# EAGLE design fbri (EAGLE 6.6.0)
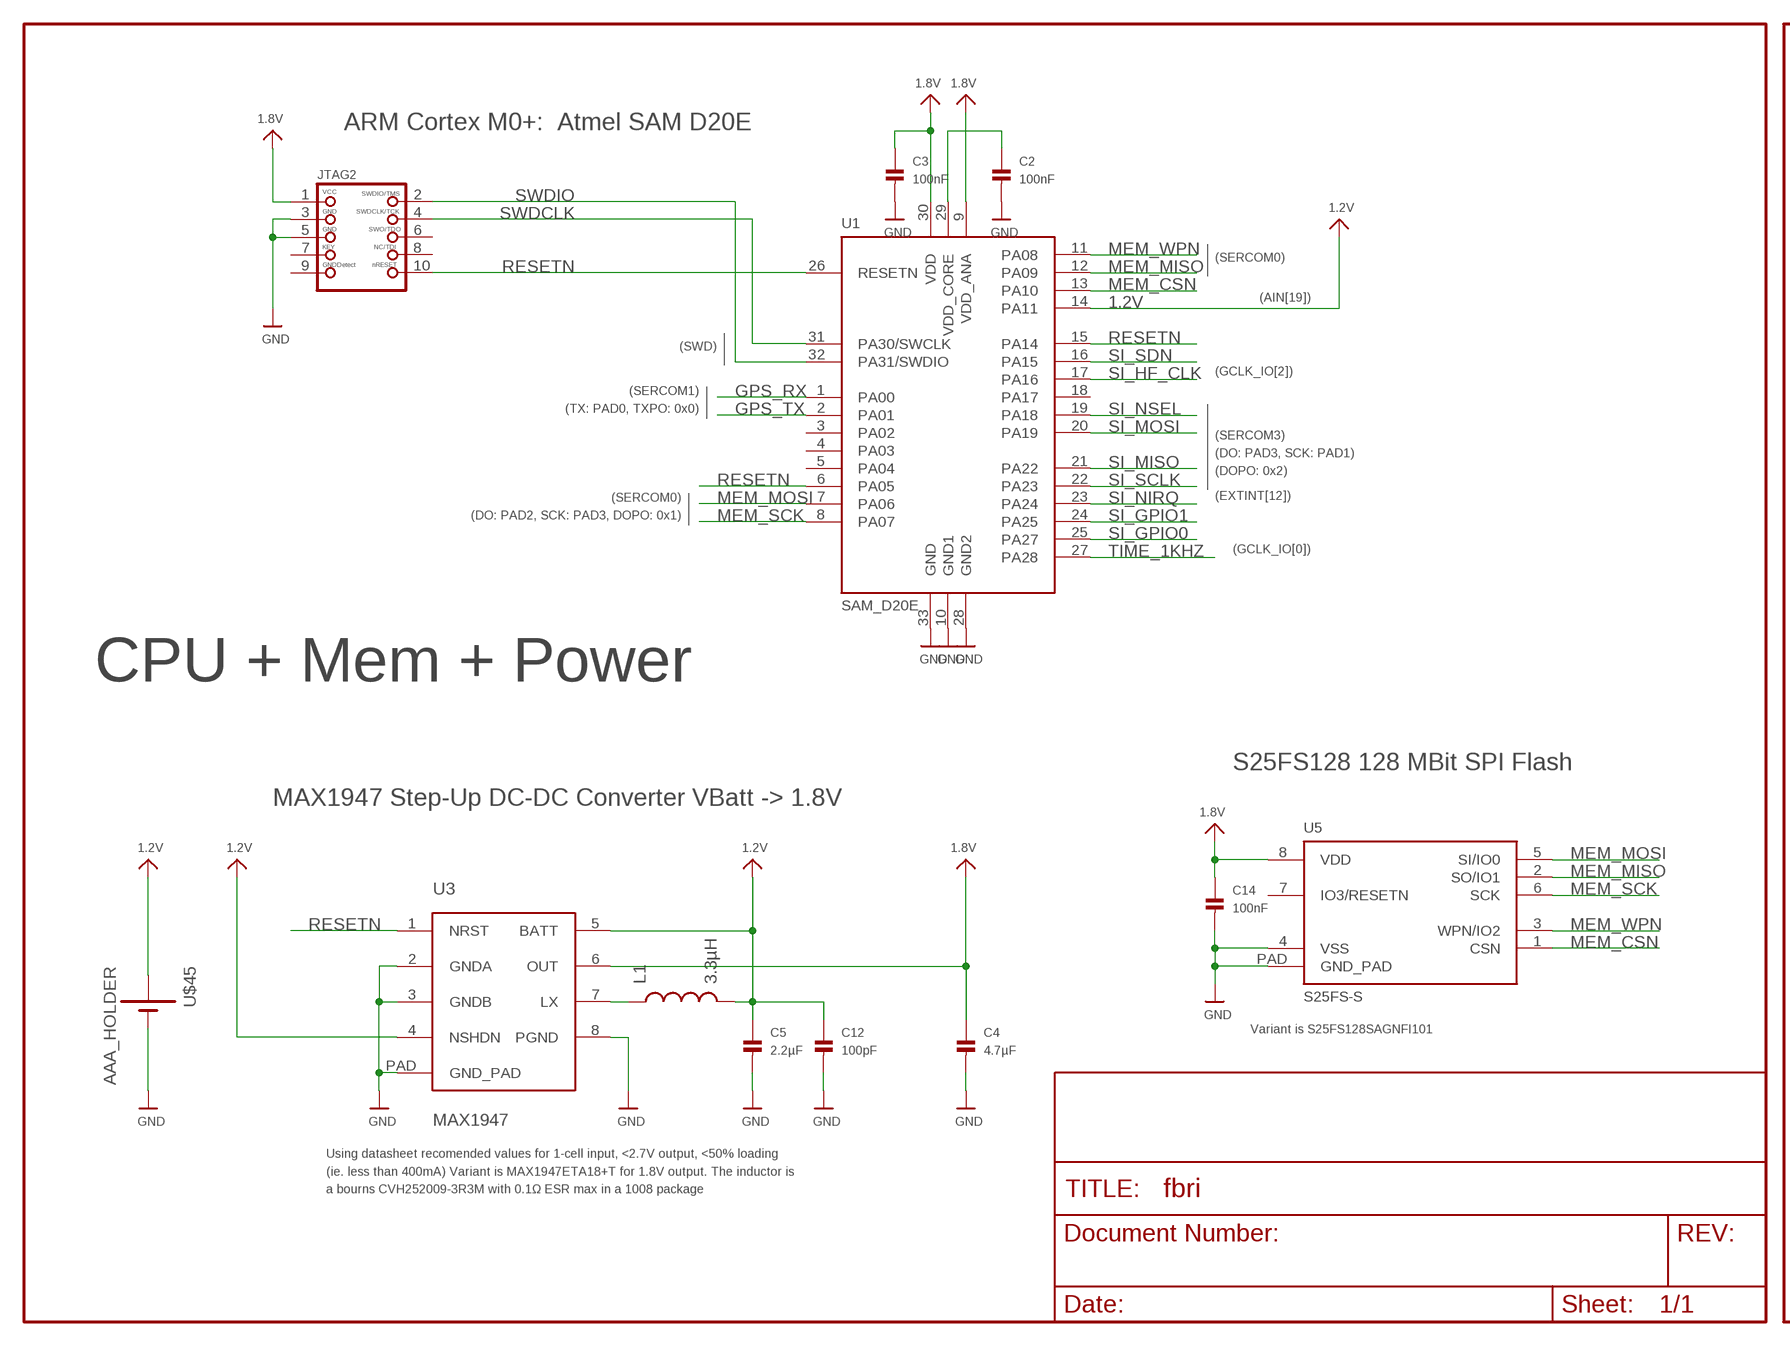
[diagram p0: schematic, sheet 1, part 1 of 2]
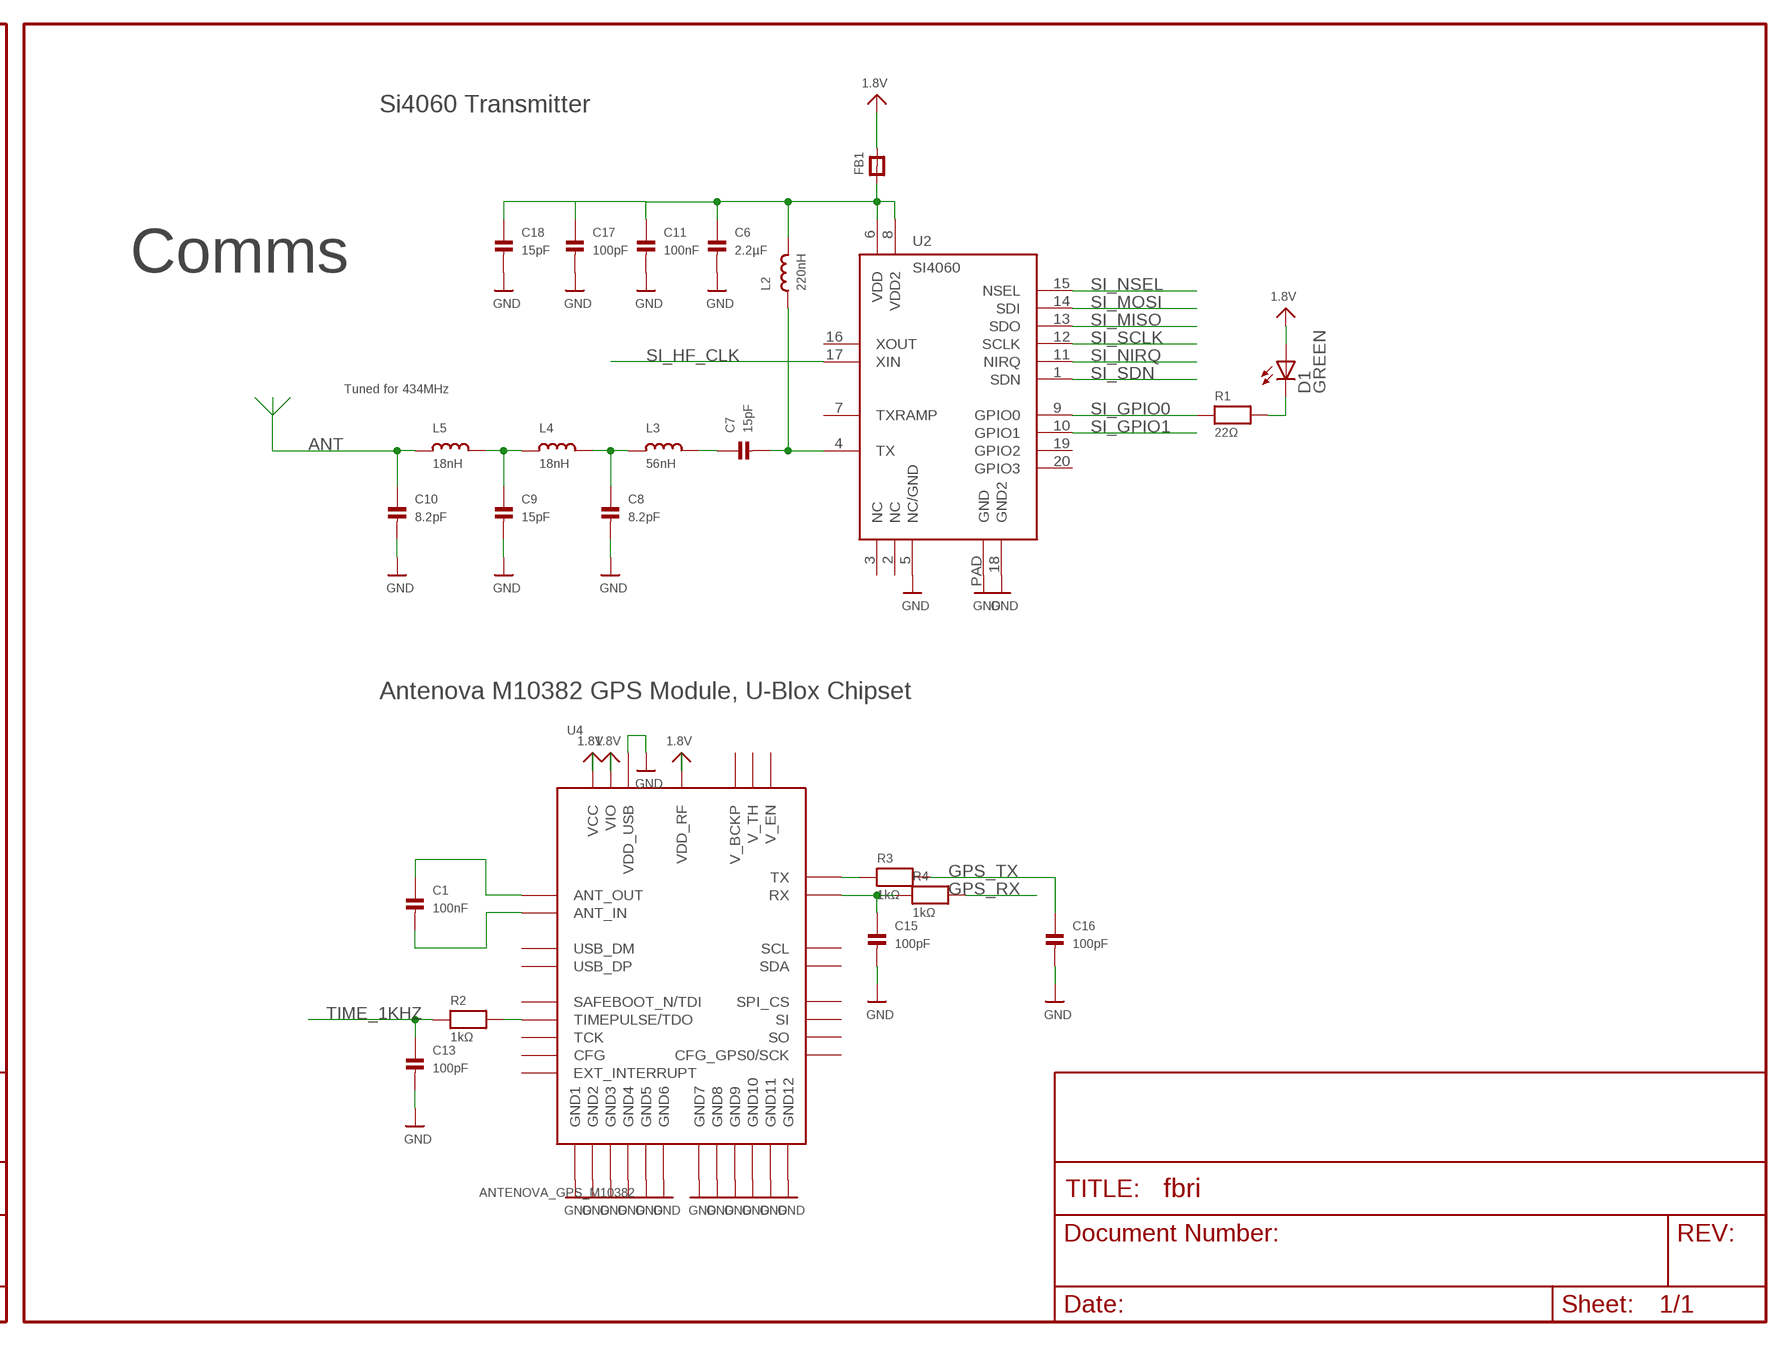
[diagram p1: schematic, sheet 1, part 2 of 2]

## Parts
C1  100nF  CAP_CERAMIC_0402  [_0402]
C2  100nF  CAP_CERAMIC_0402  [_0402]
C3  100nF  CAP_CERAMIC_0402  [_0402]
C4  4.7µF  CAP_CERAMIC_0402  [_0402]
C5  2.2µF  CAP_CERAMIC_0402  [_0402]
C6  2.2µF  CAP_CERAMIC_0402  [_0402]
C7  15pF  CAP_CERAMIC_0402  [_0402]
C8  8.2pF  CAP_CERAMIC_0402  [_0402]
C9  15pF  CAP_CERAMIC_0402  [_0402]
C10  8.2pF  CAP_CERAMIC_0402  [_0402]
C11  100nF  CAP_CERAMIC_0402  [_0402]
C12  100pF  CAP_CERAMIC_0402  [_0402]
C13  100pF  CAP_CERAMIC_0402  [_0402]
C14  100nF  CAP_CERAMIC_0402  [_0402]
C15  100pF  CAP_CERAMIC_0402  [_0402]
C16  100pF  CAP_CERAMIC_0402  [_0402]
C17  100pF  CAP_CERAMIC_0402  [_0402]
C18  15pF  CAP_CERAMIC_0402  [_0402]
D1  GREEN  LEDCHIPLED_0603  [CHIPLED_0603]
FB1  FERRITE_0402  [_0402]
JTAG2  JTAG-CORTEXM3SMT  [2X05_1.27MM_SMT]
L1  3.3µH  INDUCTOR1007  [1007]
L2  220nH  INDUCTOR_0402  [_0402]
L3  56nH  INDUCTOR_0402  [_0402]
L4  18nH  INDUCTOR_0402  [_0402]
L5  18nH  INDUCTOR_0402  [_0402]
R1  22Ω  RESISTOR_0402  [_0402]
R2  1kΩ  RESISTOR_0402  [_0402]
R3  1kΩ  RESISTOR_0402  [_0402]
R4  1kΩ  RESISTOR_0402  [_0402]
U1  SAM_D20E  [QFN32_5MM]
U2  SI4060  [QFN20]
U3  MAX1947  [TDFN8]
U4  ANTENOVA_GPS_M10382  [ANTENOVA_GPS_M10382]
U5  S25FS-S  [WSON8]
U$45  AAA_HOLDER  [AAA]

## Nets
1.2V: C5.1 C12.1 L1.2 U1.14(PA11) U3.4(NSHDN) U3.5(BATT) U$45.+2(+)
1.8V: C3.1 C4.1 C14.1 D1.A FB1.2 JTAG2.1 U1.9(VDD_ANA) U1.30(VDD) U3.6(OUT) U4.5_VIO(VIO) U4.25_VDD_RF(VDD_RF) U4.27_VCC(VCC) U5.8(VDD)
AN_GPS_RX: C15.1 R4.1 U4.13_RX(RX)
AN_GPS_TX: R3.1 U4.11_TX(TX)
ANT: C10.1 L5.1
FILTER1: C8.1 L3.1 L4.2
FILTER2: C9.1 L4.1 L5.2
GND: C2.2 C3.2 C4.2 C5.2 C6.2 C8.2 C9.2 C10.2 C11.2 C12.2 C13.2 C14.2 C15.2 C16.2 C17.2 C18.2 JTAG2.3 JTAG2.5 U1.10(GND1) U1.28(GND2) U1.33(GND) U2.5(NC/GND) U2.18(GND2) U2.PAD(GND) U3.2(GNDA) U3.3(GNDB) U3.8(PGND) U3.PAD(GND_PAD) U4.2_GND(GND1) U4.4_GND(GND2) U4.14_GND(GND3) U4.17_GND(GND4) U4.21_GND(GND5) U4.24_GND(GND6) U4.26_GND(GND7) U4.28_GND(GND8) U4.32_VDD_USB(VDD_USB) U4.33_GND(GND9) U4.34_GND(GND10) U4.35_GND(GND11) U4.36_GND(GND12) U5.4(VSS) U5.PAD(GND_PAD) U$45.-1(-) U$45.-2(-)
GPS_ANT_IN: C1.2 U4.1_ANT_IN(ANT_IN)
GPS_ANT_OUT: C1.1 U4.3_ANT_OUT(ANT_OUT)
GPS_RX: R4.2 U1.1(PA00)
GPS_TX: C16.1 R3.2 U1.2(PA01)
LED_RES: D1.C R1.2
LX: L1.1 U3.7(LX)
MEM_CSN: U1.13(PA10) U5.1(CSN)
MEM_MISO: U1.12(PA09) U5.2(SO/IO1)
MEM_MOSI: U1.7(PA06) U5.5(SI/IO0)
MEM_SCK: U1.8(PA07) U5.6(SCK)
MEM_WPN: U1.11(PA08) U5.3(WPN/IO2)
RADIO_VDD: C6.1 C11.1 C17.1 C18.1 FB1.1 L2.2 U2.6(VDD) U2.8(VDD2)
RESETN: JTAG2.10 U1.6(PA05) U1.15(PA14) U1.26(RESETN) U3.1(NRST)
RF_OUT: C7.2 L2.1 U2.4(TX)
SI_GPIO0: R1.1 U1.25(PA27) U2.9(GPIO0)
SI_GPIO1: U1.24(PA25) U2.10(GPIO1)
SI_HF_CLK: U1.17(PA16) U2.17(XIN)
SI_MISO: U1.21(PA22) U2.13(SDO)
SI_MOSI: U1.20(PA19) U2.14(SDI)
SI_NIRQ: U1.23(PA24) U2.11(NIRQ)
SI_NSEL: U1.19(PA18) U2.15(NSEL)
SI_SCLK: U1.22(PA23) U2.12(SCLK)
SI_SDN: U1.16(PA15) U2.1(SDN)
SWDCLK: JTAG2.4 U1.31(PA30/SWCLK)
SWDIO: JTAG2.2 U1.32(PA31/SWDIO)
TANK: C7.1 L3.2
TIME_1KHZ: C13.1 R2.1 U1.27(PA28)
TIME_1KHZ_DRIVE: R2.2 U4.23_TIMEPULSE/TDO(TIMEPULSE/TDO)
VDD_CORE: C2.1 U1.29(VDD_CORE)
Unconnected: JTAG2.6 JTAG2.7 JTAG2.8 JTAG2.9 U1.3(PA02) U1.4(PA03) U1.5(PA04) U1.18(PA17) U2.2(NC) U2.3(NC ) U2.7(TXRAMP) U2.16(XOUT) U2.19(GPIO2) U2.20(GPIO3) U4.6_USB_DP(USB_DP) U4.7_USB_DM(USB_DM) U4.8_SO(SO) U4.9_CFG_GPS0_SCK(CFG_GPS0/SCK) U4.10_SPI_SELECT(SPI_CS) U4.12_V_TH(V_TH) U4.15_V_BCKUP(V_BCKP) U4.16_SI(SI) U4.18_SDA(SDA) U4.19_SCL(SCL) U4.20_SAFEBOOT_N/TDI(SAFEBOOT_N/TDI) U4.22_TCK(TCK) U4.29_EXT_INTERRUPT(EXT_INTERRUPT) U4.30_V_EN(V_EN) U4.31_CFG(CFG) U5.7(IO3/RESETN)

## Notes on the sheet
- Si4060 Transmitter
- ARM Cortex M0+:  Atmel SAM D20E
- (SERCOM0)
- Comms
- (AIN[19])
- (SWD)
- (GCLK_IO[2])
- (SERCOM1) | Tuned for 434MHz
- (TX: PAD0, TXPO: 0x0)
- (SERCOM3)
- (DO: PAD3, SCK: PAD1)
- (DOPO: 0x2)
- (SERCOM0) | (EXTINT[12])
- (DO: PAD2, SCK: PAD3, DOPO: 0x1)
- (GCLK_IO[0])
- CPU + Mem + Power
- Antenova M10382 GPS Module, U-Blox Chipset
- S25FS128 128 MBit SPI Flash
- MAX1947 Step-Up DC-DC Converter VBatt -> 1.8V
- Variant is S25FS128SAGNFI101
- Using datasheet recomended values for 1-cell input, <2.7V output, <50% loading 
  (ie. less than 400mA) Variant is MAX1947ETA18+T for 1.8V output. The inductor is 
  a bourns CVH252009-3R3M with 0.1Ω ESR max in a 1008 package

## Library data of the parts
C1-C18 = microbuilder_v3:CAP_CERAMIC: Ceramic Capacitors 0402 - 0402 Surface Mount Capacitors 16pF 50V 5% [Digikey: 445-4899-2-ND] 18pF 50V 5% [Digikey: 490-1281-2-ND] 22pF 50V 5% [Digikey: 490-1283-2-ND] 68pF 50V 5% [Digikey: 490-1289-2-ND] 0.1uF 10V 10% [Digikey: 490-1318-2-ND] 1.0uF 6.3V 10% [Digikey: 490-1320-2-ND] 0603 - 0603 Surface Mount Capacitors 16 pF 50V 5% [Digikey: 445-5051-2-ND] 22 pF 50V [Digikey: PCC220ACVTR-ND] 33 pF 50V 5% [Digikey: 490-1415-1-ND] 56pF 50V 5% [Digikey: 490-1421-1-ND] 220pF 50V 5% [Digikey: 445-1285-1-ND] 680 pF 50V 2200 pF 50V 5% C0G [Digikey: 445-1297-1-ND] 5600 pF 100V 5% X7R [Digikey: 478-3711-1-ND] 0.1 µF 25V 10% [Digikey: PCC2277TR-ND] 0.22 µF 16V 10% X7R [Digikey: 445-1318-1-ND] 1.0 µF 25V 10% [Digikey: 445-5146-2-ND] 0603 - RF Specific 3pF 250V +/-0.1pF RF [Digikey: 712-1347-1-ND] 18 pF 250V 5% [Digikey: 478-3505-1-ND or 712-1322-1-ND] 56 pF 250V 5% C0G RF [Digikey: 490-4867-1-ND] 68 pF 250V RF [Digikey: 490-4868-1-ND] 0805 - 0805 Surface Mount Capacitors 220 pF 250V 2% RF Ceramic Capacitor [Digikey: 712-1398-1-ND] 1000 pF 50V 2% NP0 Ceramic Capacitor [Digikey: 478-3760-1-ND] 0.1 µF 25V 10% Ceramic Capacitor [Digikey: PCC1828TR-ND] 1.0 µF 16V 10% Ceramic Capacitor[Digikey: 490-1691-2-ND] 10.0 µF 10V 10% Ceramic Capacitor[Digikey: 709-1228-1-ND] 10.0 uF 16V 10% Ceramic Capacitor [Digikey: 478-5165-2-ND] 47 uF 6.3V 20% Ceramic Capacitor [Digikey: 587-1779-1-ND or 399-5506-1-ND] 1206 - 1206 Surface Mount Capacitors 47uF 10V 20% Ceramic Capacitor [Digikey: 490-5528-1-ND or 399-5508-1-ND or 445-6010-1-ND] 100uF 6.3V -20%, +80% Y5V Ceramic Capacitor (Digikey: 490-4512-1-ND, Mouser: 81-GRM31CF50J107ZE1L)
D1 = led:LED: LED OSRAM: - CHIPLED LG R971, LG N971, LY N971, LG Q971, LY Q971, LO R971, LY R971 LH N974, LH R974 LS Q976, LO Q976, LY Q976 LO Q996 - Hyper CHIPLED LW Q18S LB Q993, LB Q99A, LB R99A - SideLED LS A670, LO A670, LY A670, LG A670, LP A670 LB A673, LV A673, LT A673, LW A673 LH A674 LY A675 LS A676, LA A676, LO A676, LY A676, LW A676 LS A679, LY A679, LG A679 - Hyper Micro SIDELED® LS Y876, LA Y876, LO Y876, LY Y876 LT Y87S - SmartLED LW L88C, LW L88S LB L89C, LB L89S, LG L890 LS L89K, LO L89K, LY L89K LS L896, LA L896, LO L896, LY L896 - TOPLED LS T670, LO T670, LY T670, LG T670, LP T670 LSG T670, LSP T670, LSY T670, LOP T670, LYG T670 LG T671, LOG T671, LSG T671 LB T673, LV T673, LT T673, LW T673 LH T674 LS T676, LA T676, LO T676, LY T676, LB T676, LH T676, LSB T676, LW T676 LB T67C, LV T67C, LT T67C, LS T67K, LO T67K, LY T67K, LW E67C LS E67B, LA E67B, LO E67B, LY E67B, LB E67C, LV E67C, LT E67C LW T67C LS T679, LY T679, LG T679 LS T770, LO T770, LY T770, LG T770, LP T770 LB T773, LV T773, LT T773, LW T773 LH T774 LS E675, LA E675, LY E675, LS T675 LS T776, LA T776, LO T776, LY T776, LB T776 LHGB T686 LT T68C, LB T68C - Hyper Mini TOPLED® LB M676 - Mini TOPLED Santana® LG M470 LS M47K, LO M47K, LY M47K Source: http://www.osram.convergy.de LUXEON: - LUMILED® LXK2-PW12-R00, LXK2-PW12-S00, LXK2-PW14-U00, LXK2-PW14-V00 LXK2-PM12-R00, LXK2-PM12-S00, LXK2-PM14-U00 LXK2-PE12-Q00, LXK2-PE12-R00, LXK2-PE12-S00, LXK2-PE14-T00, LXK2-PE14-U00 LXK2-PB12-K00, LXK2-PB12-L00, LXK2-PB12-M00, LXK2-PB14-N00, LXK2-PB14-P00, LXK2-PB14-Q00 LXK2-PR12-L00, LXK2-PR12-M00, LXK2-PR14-Q00, LXK2-PR14-R00 LXK2-PD12-Q00, LXK2-PD12-R00, LXK2-PD12-S00 LXK2-PH12-R00, LXK2-PH12-S00 LXK2-PL12-P00, LXK2-PL12-Q00, LXK2-PL12-R00 Source: www.luxeon.com KINGBRIGHT: KA-3528ASYC Source: www.kingbright.com
FB1 = microbuilder_v3:FERRITE: Ferrite Bead 0603 MMZ1608B121C - 120 Ohm @ 100MHz, 600mA, 0.15 Ohm DC Resistance - Digikey: 445-2164-1-ND BK1608HW121-T - 120 Ohm, 600mA Ferrite Chip - Digikey: 587-1876-2-ND 0805 HZ0805B272R-10 - 2.7K Ohm @ 100MHz, 200mA, 0.8 Ohm DC Resistance - Digikey: 240-2504-1-ND (see also Murata BLM21BD272SN1L) MMZ2012Y152B - 1.5K Ohm @ 100MHz, 500mA, 0.4 Ohm DC Resistance - Digikey: 445-1560-1-ND - Mainly for high frequency (80-400MHz) MMZ2012R102A - 1K Ohm @ 100MHz, 500mA, 0.3 Ohm DC Resistance - Digikey: 445-1555-2-ND - More general purpose (10-200MHz)
JTAG2 = microbuilder_v3:JTAG-CORTEXM3: Serial Wire (SW-DP) Connector This standard 0.05" 10-pin connector is for use with the Cortex M0/M3's native SWD (serial wire debugger) interface (SW-DP). Some boards support a 20-pin combined JTAG+SWD connector (SWJ-DP), such as the LPC1700 family, but many smaller devices only work with SWD which typically use the smaller 10-pin SW-DP connecter (the LPC1300 family, for example, only supports SWD). 2x05 1.27mm/0.05" Connector: This is the standard SMT connector defined by ARM for all Cortex devices, and should be used in most situations and for forward-compatibility since any new devices coming to market will likely use this connector. MOLEX 10 Pin 0.1" Connector: This 0.1" 10 pin connector has the same pin layout as the standard 0.05" connector, but is easier to work with if you are using standard jumper wires or custom cables to connect your SWD hardware. MOLEX 20 Pin 0.1" Connector: This 0.1" 20 pin connector is the same model used for ARM7/ARM9 JTAG debuggers, but is connected to match the pins on the Segger J-Link for ARM (which supports both JTAG and SWD debugging). See the following document from ARM for more information on Cortex M3 Debug Connectors: http://infocenter.arm.com/help/topic/com.arm.doc.faqs/attached/13634/cortex_debug_connectors.pdf And the following page for an overview with images of the different connector types: http://www.keil.com/peripherals/coresight/connectors.asp
L1 = SparkFun:INDUCTOR: Inductors
L2-L5 = microbuilder_v3:INDUCTOR: Inductors
R1-R4 = microbuilder_v3:RESISTOR: Resistors 0402 - 0402 Surface Mount Package 22 Ohm 1% 1/16W [Digikey: 311-22.0LRTR-ND] 33 Ohm 5% 1/16W 1.0K 5% 1/16W 1.5K 5% 1/16W 2.0K 1% 1/16W 10.0K 1% 1/16W [Digikey: 311-10.0KLRTR-ND] 10.0K 5% 1/16W [Digikey: RMCF0402JT10K0TR-ND] 12.1K 1% 1/16W [Digikey: 311-22.0LRTR-ND] 100.0K 5% 1/16W 0603 - 0603 Surface Mount Package 0 Ohm 1/10 Watt 1% Resistor 15 Ohm 1/10 Watt 1% Resistor 33 Ohm 1/10 Watt 1% Resistor 49.9 Ohm 1/10 Watt 1% Resistor 100 Ohm 1/10 Watt 1% Resistor 150 Ohm 1/10 Watt 1% Resistor 240 Ohm 1/10 Watt 1% Resistor 390 Ohm 1/10 Watt 1% Resistor 560 Ohm 1/10 Watt 1% Resistor 680 Ohm 1/10 Watt 1% Resistor 750 Ohm 1/10 Watt 1% Resistor 1.0K Ohm 1/10 Watt 1% Resistor 1.5K Ohm 1/10 Watt 1% Resistor 2.0K Ohm 1/10 Watt 1% Resistor 2.2K Ohm 1/10 Watt 1% Resistor 3.3K Ohm 1/10 Watt 1% Resistor 4.7K Ohm 1/10 Watt 1% Resistor 10.0K Ohm 1/10 Watt 1% Resistor 12.0K Ohm 1/10 Watt 1% Resistor 12.1K Ohm 1/10 Watt 1% Resistor 20.0K Ohm 1/10 Watt 1% Resistor 33.0K Ohm 1/10 Watt 1% Resistor 100.0K Ohm 1/10 Watt 1% Resistor 0805 - 0805 Surface Mount Package 0 Ohm 1/8 Watt 1% Resistor 33 Ohm 1/8 Watt 1% Resistor 100 Ohm 1/8 Watt 1% Resistor 150 Ohm 1/8 Watt 1% Resistor 200 Ohm 1/8 Watt 1% Resistor 240 Ohm 1/8 Watt 1% Resistor 330 Ohm 1/8 Watt 1% Resistor 390 Ohm 1/8 Watt 1% Resistor 470 Ohm 1/8 Watt 1% Resistor 1.0K Ohm 1/8 Watt 1% Resistor 1.5K Ohm 1/8 Watt 1% Resistor 2.0K Ohm 1/8 Watt 1% Resistor 4.7K Ohm 1/8 Watt 1% Resistor 5.1K Ohm 1/8 Watt 1% Resistor 5.6K Ohm 1/8 Watt 1% Resistor 10.0K Ohm 1/8 Watt 1% Resistor 22.0K Ohm 1/8 Watt 1% Resistor 33.0K Ohm 1/8 Watt 1% Resistor 100K Ohm 1/8 Watt 1% Resistor 1206 - 1206 Surface Mount Package 2012 - 2010 Surface Mount Package 0.11 Ohm 1/2 Watt 1% Resistor - Digikey: RHM.11UCT-ND
U1 = fbri:SAM_D20E
U2 = fbri:SI4060
U3 = fbri:MAX1947
U4 = fbri:ANTENOVA_GPS_M10382
U5 = fbri:S25FS-S
U$45 = fbri:AAA_HOLDER

## Board
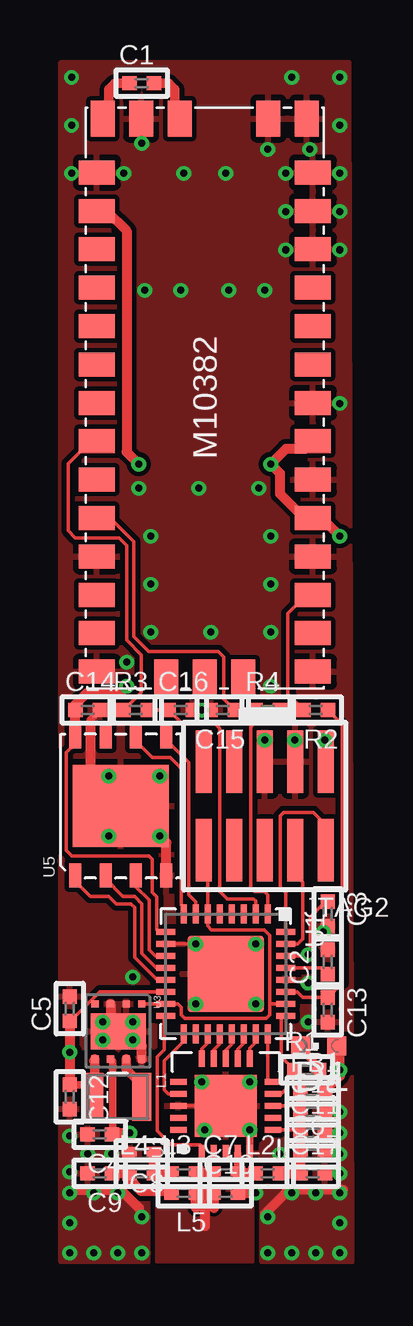
[diagram p2: board, top side]
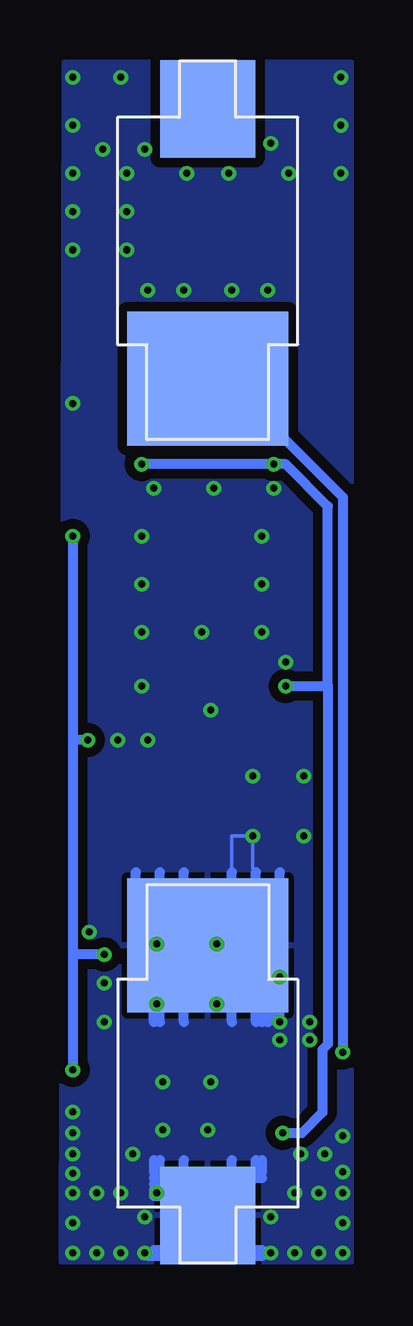
[diagram p3: board, bottom side, seen from below]

No outline drawn. Coordinates in mm, seen from the top.
Copper layers (1*16): Top 0.035mm / dielectric 1.5mm / Bottom 0.035mm
Design rules "hackvana": minimum track width 6mil, minimum drill 0.3mm, track to track 6mil, track to pad 6mil, pad to pad 6mil, via to via 6mil, smd to smd 0mil, copper to edge 6mil, drill to drill 6mil, minimum pad ring 10mil, minimum via ring 6mil, stop-mask expansion 2mil, vias tented up to drill 100mil, thermal gap 10mil

### Footprints (pad centres in the part's own frame; a part is rotated, then mirrored left to right if it is on the bottom)
_0402 = smd 0.6 x 0.6: 1 -0.508,0; 2 0.508,0
CHIPLED_0603 = smd 0.8 x 0.8: A 0,-0.75; C 0,0.75
2X05_1.27MM_SMT = smd 0.65 x 2.6: 1 -2.54,-1.85; 2 -2.54,1.85; 3 -1.27,-1.85; 4 -1.27,1.85; 5 0,-1.85; 6 0,1.85; 7 1.27,-1.85; 8 1.27,1.85; 9 2.54,-1.85; 10 2.54,1.85
1007 = smd 2 x 0.8: 1 0,1; 2 0,-1
QFN32_5MM = smd 0.8 x 0.25: 1 -2.5,1.75; 2 -2.5,1.25; 3 -2.5,0.75; 4 -2.5,0.25; 5 -2.5,-0.25; 6 -2.5,-0.75; 7 -2.5,-1.25; 8 -2.5,-1.75; 17 2.5,-1.75; 18 2.5,-1.25; 19 2.5,-0.75; 20 2.5,-0.25; 21 2.5,0.25; 22 2.5,0.75; 23 2.5,1.25; 24 2.5,1.75 | smd 0.25 x 0.8: 9 -1.75,-2.5; 10 -1.25,-2.5; 11 -0.75,-2.5; 12 -0.25,-2.5; 13 0.25,-2.5; 14 0.75,-2.5; 15 1.25,-2.5; 16 1.75,-2.5; 25 1.75,2.5; 26 1.25,2.5; 27 0.75,2.5; 28 0.25,2.5; 29 -0.25,2.5; 30 -0.75,2.5; 31 -1.25,2.5; 32 -1.75,2.5 | smd 3.2 x 3.2: 33 0,0
QFN20 = smd 0.7 x 0.25: 1 -1.97,1; 2 -1.97,0.5; 3 -1.97,0; 4 -1.97,-0.5; 5 -1.97,-1; 11 1.97,-1; 12 1.97,-0.5; 13 1.97,0; 14 1.97,0.5; 15 1.97,1 | smd 0.25 x 0.7: 6 -1,-1.97; 7 -0.5,-1.97; 8 0,-1.97; 9 0.5,-1.97; 10 1,-1.97; 16 1,1.97; 17 0.5,1.97; 18 0,1.97; 19 -0.5,1.97; 20 -1,1.97 | smd 2.6 x 2.6: PAD 0,0
TDFN8 = smd 0.3 x 0.3: 1 -1.125,1; 2 -1.125,0.35; 3 -1.125,-0.3; 4 -1.125,-0.95; 5 1.175,-0.95; 6 1.175,-0.3; 7 1.175,0.35; 8 1.175,1 | smd 1.5 x 2.3: PAD 0.025,0.025
ANTENOVA_GPS_M10382 = smd 1 x 1.5: 1_ANT_IN -1.05,11.65; 2_GND -2.65,11.65; 3_ANT_OUT -4.25,11.65; 18_SDA -1.6,-11.65; 19_SCL 0,-11.65; 20_SAFEBOOT_N/TDI 1.6,-11.65; 35_GND 4.25,11.65; 36_GND 2.65,11.65 | smd 1.5 x 1: 4_GND -4.5,9.4; 5_VIO -4.5,7.8; 6_USB_DP -4.5,6.2; 7_USB_DM -4.5,4.6; 8_SO -4.5,3; 9_CFG_GPS0_SCK -4.5,1.4; 10_SPI_SELECT -4.5,-0.2; 11_TX -4.5,-1.8; 12_V_TH -4.5,-3.4; 13_RX -4.5,-5; 14_GND -4.5,-6.6; 15_V_BCKUP -4.5,-8.2; 16_SI -4.5,-9.8; 17_GND -4.5,-11.4; 21_GND 4.5,-11.4; 22_TCK 4.5,-9.8; 23_TIMEPULSE/TDO 4.5,-8.2; 24_GND 4.5,-6.6; 25_VDD_RF 4.5,-5; 26_GND 4.5,-3.4; 27_VCC 4.5,-1.8; 28_GND 4.5,-0.2; 29_EXT_INTERRUPT 4.5,1.4; 30_V_EN 4.5,3; 31_CFG 4.5,4.6; 32_VDD_USB 4.5,6.2; 33_GND 4.5,7.8; 34_GND 4.5,9.4
WSON8 = smd 1 x 0.5: 1 -2.9,1.905; 2 -2.9,0.635; 3 -2.9,-0.635; 4 -2.9,-1.905; 5 2.9,-1.905; 6 2.9,-0.635; 7 2.9,0.635; 8 2.9,1.905 | smd 3.4 x 4: PAD 0,0
AAA = smd 3.962 x 4.064: +1 0,23.063; -1 0,-23.063 | smd 6.706 x 5.588: +2 0,11.811; -2 0,-11.811

### Placement (x,y rotation side)
C1  3.38,49.12 0 top
C2  11.12,12.5 90 top
C3  11.12,14.5 270 top
C4  1.62,5.31 180 top
C5  0.38,10.55 90 top
C6  10.5,4.5 0 top
C7  6.88,3.69 0 top
C8  3.38,4.5 180 top
C9  1.62,3.69 180 top
C10  6.88,2.88 0 top
C11  10.5,5.38 0 top
C12  0.38,6.88 270 top
C13  11.12,10.5 270 top
C14  1.12,23 0 top
C15  6.75,23 180 top
C16  5,23 0 top
C17  10.5,3.69 0 top
C18  10.5,6.25 0 top
D1  10.75,9 90 top
FB1  10.5,7.12 0 top
JTAG2  8.5,19 180 top
L1  2.38,6.88 270 top
L2  8.62,3.69 0 top
L3  5.12,3.69 0 top
L4  3.38,3.69 0 top
L5  5.12,2.88 180 top
R1  10.25,8 0 top
R2  10.62,23 180 top
R3  3.12,23 0 top
R4  8.62,23 0 top
U1  6.88,12 270 top
U2  6.88,6.5 90 top
U3  2.38,9.62 270 top
U4  6,36 0 top
U5  2.5,19 90 top
U$45  6,25 0 bottom

### Tracks (layer width: path | path; a pad name or v marks a point on that pad's centre or on a via)
1.2V  (via drill 0.3)
  Top 0.152: U1.14 1.63,11.25 1.25,10.87 | 1.25,10.87 0.55,10.17 C5.1 | U3.4 1.3,10.87 1.25,10.87
  Top 0.305: U3.5 1.34,8.37 | 1.43,7.36 1.41,7.38 C12.1 0.36,7.37 | C5.1 0.36,10.06
  Top 0.4: U3.5 1.43,7.36 1.43,6.88 L1.2
  Top 0.406: C5.1 v0.38,8.73 C12.1
  Bottom 0.406: v0.38,8.73 0.38,31.88 5.31,36.81 U$45.+2
1.8V  (via drill 0.3)
  Top 0.152: U1.30 10.25,12.75 v10.31,12.81 10.39,12.89 10.39,14.37 11.03,15.01 C3.1 | U5.8 0.59,21.59 0.23,21.23 0.23,17.14 0.46,16.92 3.66,16.92 3.81,16.76 3.81,15.39 4,15.2 4,13.83 4.12,13.72 4.34,13.72 U1.9
  Top 0.305: 2.2,5.38 2.16,5.34 | U3.6 2.16,8.36 2.16,5.34 | 2.16,5.34 C4.1
  Top 0.406: FB1.2 11.62,7.74 v11.62,8 11.62,8.88 D1.A | U5.8 0.59,22.98 C14.1 0.62,23.25 1.07,23.7 2.45,23.7 v2.75,24 | 2.16,5.34 2.2,5.38 v2.88,5.38 | U4.5_VIO 1.92,43.8 2.74,42.98 2.74,33.76 v3.25,33.25 | U4.25_VDD_RF 10.15,31 9.14,32 9.14,32.86 v8.75,33.25 9.39,33.9 10.2,33.9 U4.27_VCC | 10.75,31 U4.25_VDD_RF | v11.62,30.25 10.88,31 U4.25_VDD_RF | JTAG2.1 11.04,21.71 v11,21.75
  Bottom 0.406: 0.99,24.01 0.99,9.07 1.22,8.84 1.22,6.23 2.07,5.38 v2.88,5.38 | v2.75,24 1,24 0.99,24.01 | 0.99,24.01 0.99,31.49 2.75,33.25 v3.25,33.25 v8.75,33.25 | v11.62,30.25 11.62,21.75 | 11.62,21.75 11.62,12.81 | 11.62,12.81 v11.62,8 | v11,21.75 11.62,21.75 | 10.25,12.75 v10.31,12.81 11.62,12.81
AN_GPS_RX
  Top 0.152: U4.13_RX 2.07,31 3.05,30.02 3.05,26.06 3.66,25.44 6.55,25.44 6.78,25.21 6.78,23.46 7.24,23 C15.1 R4.1
AN_GPS_TX
  Top 0.152: 1.29,34.2 U4.11_TX 1.23,34.2 0.3,33.27 0.3,30.47 0.61,30.17 2.44,30.17 2.74,29.86 2.74,25.91 3.35,25.3 3.35,23.74 R3.1
ANT
  Top 0.152: 6,2.75 5.88,2.88 L5.1
  Top 0.406: L5.1 C10.1 | 6,2.75 6,1.5
  pour Top: 4,0 8,0 8,2.25 4,2.25
FILTER1
  Top 0.406: L3.1 L4.2 C8.1
FILTER2
  Top 0.406: C9.1 L4.1 2.87,3.43 3.35,2.94 4.55,2.94 L5.2
GND  (via drill 0.3)
  Top 0.152: U1.10 v5.62,13.25 U1.33 | U2.18 5.62,6.5 5.88,6.25 | U5.PAD 1.25,17.75 | C14.2 1.25,22.62 1.25,20.25 v2,20.25 v4.12,20.25
  Top 0.305: 5.88,6.25 v6,5.5 | U2.5 v7.88,5.5 | C14.2 1.22,22.59 1.22,22.43
  Top 0.406: U5.4 4.41,17.47 v4.12,17.75 | U3.8 3.38,9 v3,9.25 2.77,9.6 U3.PAD 2.08,9.93 U3.3 | 0.5,3 2.5,3 3.25,2.25 | 11.75,3 9.5,3 8.5,2 | 1.22,22.43 1.22,19.96 2.18,19 U5.PAD | C3.2 11.12,13.94 v10.94,13.75 | C10.2 v8.12,2.88
  Bottom 0.152: 4,16.25 4.12,16.38 v4.12,17.75 5,17.75 5,16.25 | 4,15.75 3,15.75 | 5,15.75 7,15.75 8,15.75 9,15.75 | 8.25,2.75 8.25,2.88 | 8.25,2.88 8.25,3 8.25,3.25 | 8.25,3.5 8.25,3.75 8,3.75 | 8.25,2.88 v8.12,2.88 | 7.75,3.5 7.75,3.75 7,3.75 | 5,3.75 4.25,3.75 4.25,3.5 | 4,3.75 3.75,3.75 3.75,3.5 | v3.38,0.38 3.75,0.38 3.75,0.25 | 4.25,0.5 4.25,0.25 | 8.25,0.5 8.62,0.5 v8.62,0.38 | v8.12,10.75 8.25,10.75 8.25,10.5 | v3,11.88 3.25,11.88 v3,10
  Bottom 0.406: 5,10 5,10.5 | 4,10 4,10.5 | 3.5,10 3.5,10.5 | 3.25,10.38 v3,10 3,10.5 | 3.75,10 3.75,10.5 | 7,10 7,10.5 | 8,10 8,10.5 | 8.25,10 8.25,10.5 | 7,3.75 7,4.25 | 8,3.75 8,4.25 | 8.25,3.5 7.75,3.5 | 8.25,4.25 8.25,3.75 | 5,3.75 5,4.25 | 4,3.75 4,4.25 | 4.25,3.5 3.75,3.5 | 3.75,4.25 3.75,3.75 | 4.25,0.25 3.75,0.25 | 4.25,0.5 3.75,0.5 | 8.25,0.5 7.75,0.5 | 8.5,0.25 8,0.25 | 8.25,2.75 7.75,2.75 | 8.25,3 7.75,3 | 8.25,3.25 7.75,3.25 | 5,15.75 5,16.25 | 4,15.75 4,16.25 | 3,15.75 3,16.25 | 7,15.75 7,16.25 | 8,15.75 8,16.25 | 9,15.75 9,16.25
  other vias: 8.5,21.75 9.75,21.75 5.62,10.75 8.12,13.25 5.88,7.5 7.88,7.5 2.12,4.5 0.38,3.75 1.12,4.5 10.31,11.62 1.75,10 1.75,9.25 0.38,5.25 5.88,23 10.31,10 11.62,6.25 11.62,5.38 11.62,4.5 11.62,3.69 9.12,4.5 0.38,2.88 0.38,1.62 0.38,0.38 1.38,0.38 2.38,0.38 3.38,1.88 2.38,2.88 1.38,2.88 9.62,0.38 10.62,0.38 11.62,0.38 11.62,1.62 11.62,2.88 10.62,2.88 9.62,2.88 8.62,1.88 0.46,45.38 11.62,35.77 11.62,42.17 11.62,43.77 11.62,45.38 2.75,25 3.25,32.25 5.75,32.25 8.25,32.25 8.75,24 8.75,26.25 8.75,28.25 8.75,30.25 3.75,30.25 3.75,28.25 3.75,26.25 6.25,26.25 5,40.5 3.5,40.5 7,40.5 8.5,40.5 2,17.75 9.38,42.17 9.38,43.77 9.38,45.38 3.38,46.62 2.62,45.38 8.62,46.38 10.38,46.38 0.46,47.38 0.46,49.38 11.62,47.38 11.62,49.38 9.62,49.38 5.12,45.38 6.88,45.38
  pour Top (isolate 0.2): 0,50 12,50 12.12,0 8.38,0 8.38,3 3.62,3 3.62,0 0,0
  pour Bottom (isolate 0.406): 0,50 12,50 12.12,0 0,0
GPS_ANT_IN
  Top 0.4: C1.2 4.5,49.12 4.75,48.88 4.75,47.85 U4.1_ANT_IN
GPS_ANT_OUT
  Top 0.4: C1.1 2.25,49.12 2,48.88 2,47.9 U4.3_ANT_OUT
GPS_RX
  Top 0.152: U1.1 8.62,15.3 8.49,15.44 8.08,15.44 7.92,15.59 7.92,22.3 8.08,22.45 8.58,22.45 R4.2
GPS_TX
  Top 0.152: U1.2 8.12,15.04 8.03,15.14 6.93,15.14 6.63,15.44 6.63,22.22 6.4,22.45 5.04,22.45 C16.1 R3.2
LED_RES
  Top 0.305: R1.2 10.75,8.12 10,8.88 D1.C
LX
  Top 0.4: U3.7 2.73,8.03 3.38,7.38 L1.1
MEM_CSN
  Top 0.152: U1.13 4.02,11.75 3.08,12.7 3.08,14.78 2.92,14.93 2.31,14.93 2.01,15.23 1.22,15.23 0.59,15.86 U5.1
MEM_MISO
  Top 0.152: U1.12 3.98,12.25 3.38,12.85 3.38,14.93 3.08,15.23 2.59,15.23 1.86,15.96 U5.2
MEM_MOSI
  Top 0.152: U5.5 4.42,21.63 4.52,21.63 5.33,20.82 5.33,15.29 5.62,15 U1.7
MEM_SCK
  Top 0.152: U5.6 3.13,21.7 3.81,21.02 4.57,21.02 5.03,20.57 5.03,14.89 5.12,14.79 U1.8
MEM_WPN
  Top 0.152: U1.11 3.94,12.75 3.69,13 3.69,15.08 3.13,15.63 U5.3
N$1
  Top 0.406: 5.62,2.25 5.62,2.88 6.38,2.88 6.38,2.25
RADIO_VDD
  Top 0.152: U2.8 9.99,6.5 C18.1 | U2.6 9.99,5.5 C11.1
  Top 0.406: FB1.1 C18.1 C11.1 C6.1 C17.1 L2.2
RESETN
  Top 0.152: 3.38,10.78 U3.1 U1.15 4.87,10.75 5.02,10.6 5.02,10.3 5.17,10.14 8.56,10.14 8.71,10.3 8.71,10.72 | U1.26 8.75,10.75 8.71,10.72 | 8.71,10.72 8.71,13.61 8.49,13.84 6.28,13.84 6.12,13.99 U1.6 | U1.6 | JTAG2.10 6,16.86 6,16 6.12,15.88 U1.6
RF_OUT
  Top 0.305: 7.62,3.69 C7.2 U2.4
  Top 0.406: L2.1 C7.2
SI_GPIO0
  Top 0.152: U2.9 9.19,7 9.42,7.24 9.42,7.68 R1.1 9.2,8.55 9.2,10.22 U1.25
SI_GPIO1
  Top 0.152: U1.24 8.62,7.5 U2.10
SI_HF_CLK
  Top 0.152: U2.17 4.48,7 4.32,7.16 4.32,8.38 5.08,9.14 5.08,9.46 U1.17
SI_MISO
  Top 0.152: U1.21 7.12,9.05 6.88,8.8 U2.13
SI_MOSI
  Top 0.152: U1.20 6.62,9.09 6.38,8.84 U2.14
SI_NIRQ
  Top 0.152: U1.23 8.12,9.14 7.88,8.89 U2.11
SI_NSEL
  Top 0.152: U1.19 6.12,9.12 5.88,8.87 U2.15
SI_SCLK
  Top 0.152: U1.22 7.62,9.1 7.38,8.85 U2.12
SI_SDN
  Top 0.152: U1.16 4.32,10.19 4.32,8.84 4.01,8.53 4.01,5.46 4.6,4.88 5.81,4.88 5.88,4.81 U2.1 5.88,4.72
SWDCLK
  Top 0.152: JTAG2.4 9.77,16.13 10.09,15.81 10.09,13.46 9.88,13.25 U1.31
SWDIO
  Top 0.152: 9.36,13.76 U1.32 9.38,15.39 9.14,15.62 9.14,18.59 9.3,18.74 10.52,18.74 11.04,18.21 JTAG2.2
TANK
  Top 0.406: C7.1 L3.2
TIME_1KHZ
  Top 0.152: U1.27 9.86,11.25 10.09,11.02 11.11,11.02 C13.1 11.73,11.62 11.73,22.4 R2.1
TIME_1KHZ_DRIVE
  Top 0.152: U4.23_TIMEPULSE/TDO 10.23,27.8 9.45,27.02 9.45,23.67 R2.2
VDD_CORE
  Top 0.152: U1.29 10.87,12.25 C2.1

### Text on the board
tStop: fbri